# EAGLE schematic SparkFun_GPS_ZED-F9K_pHat (EAGLE 9.5.2)
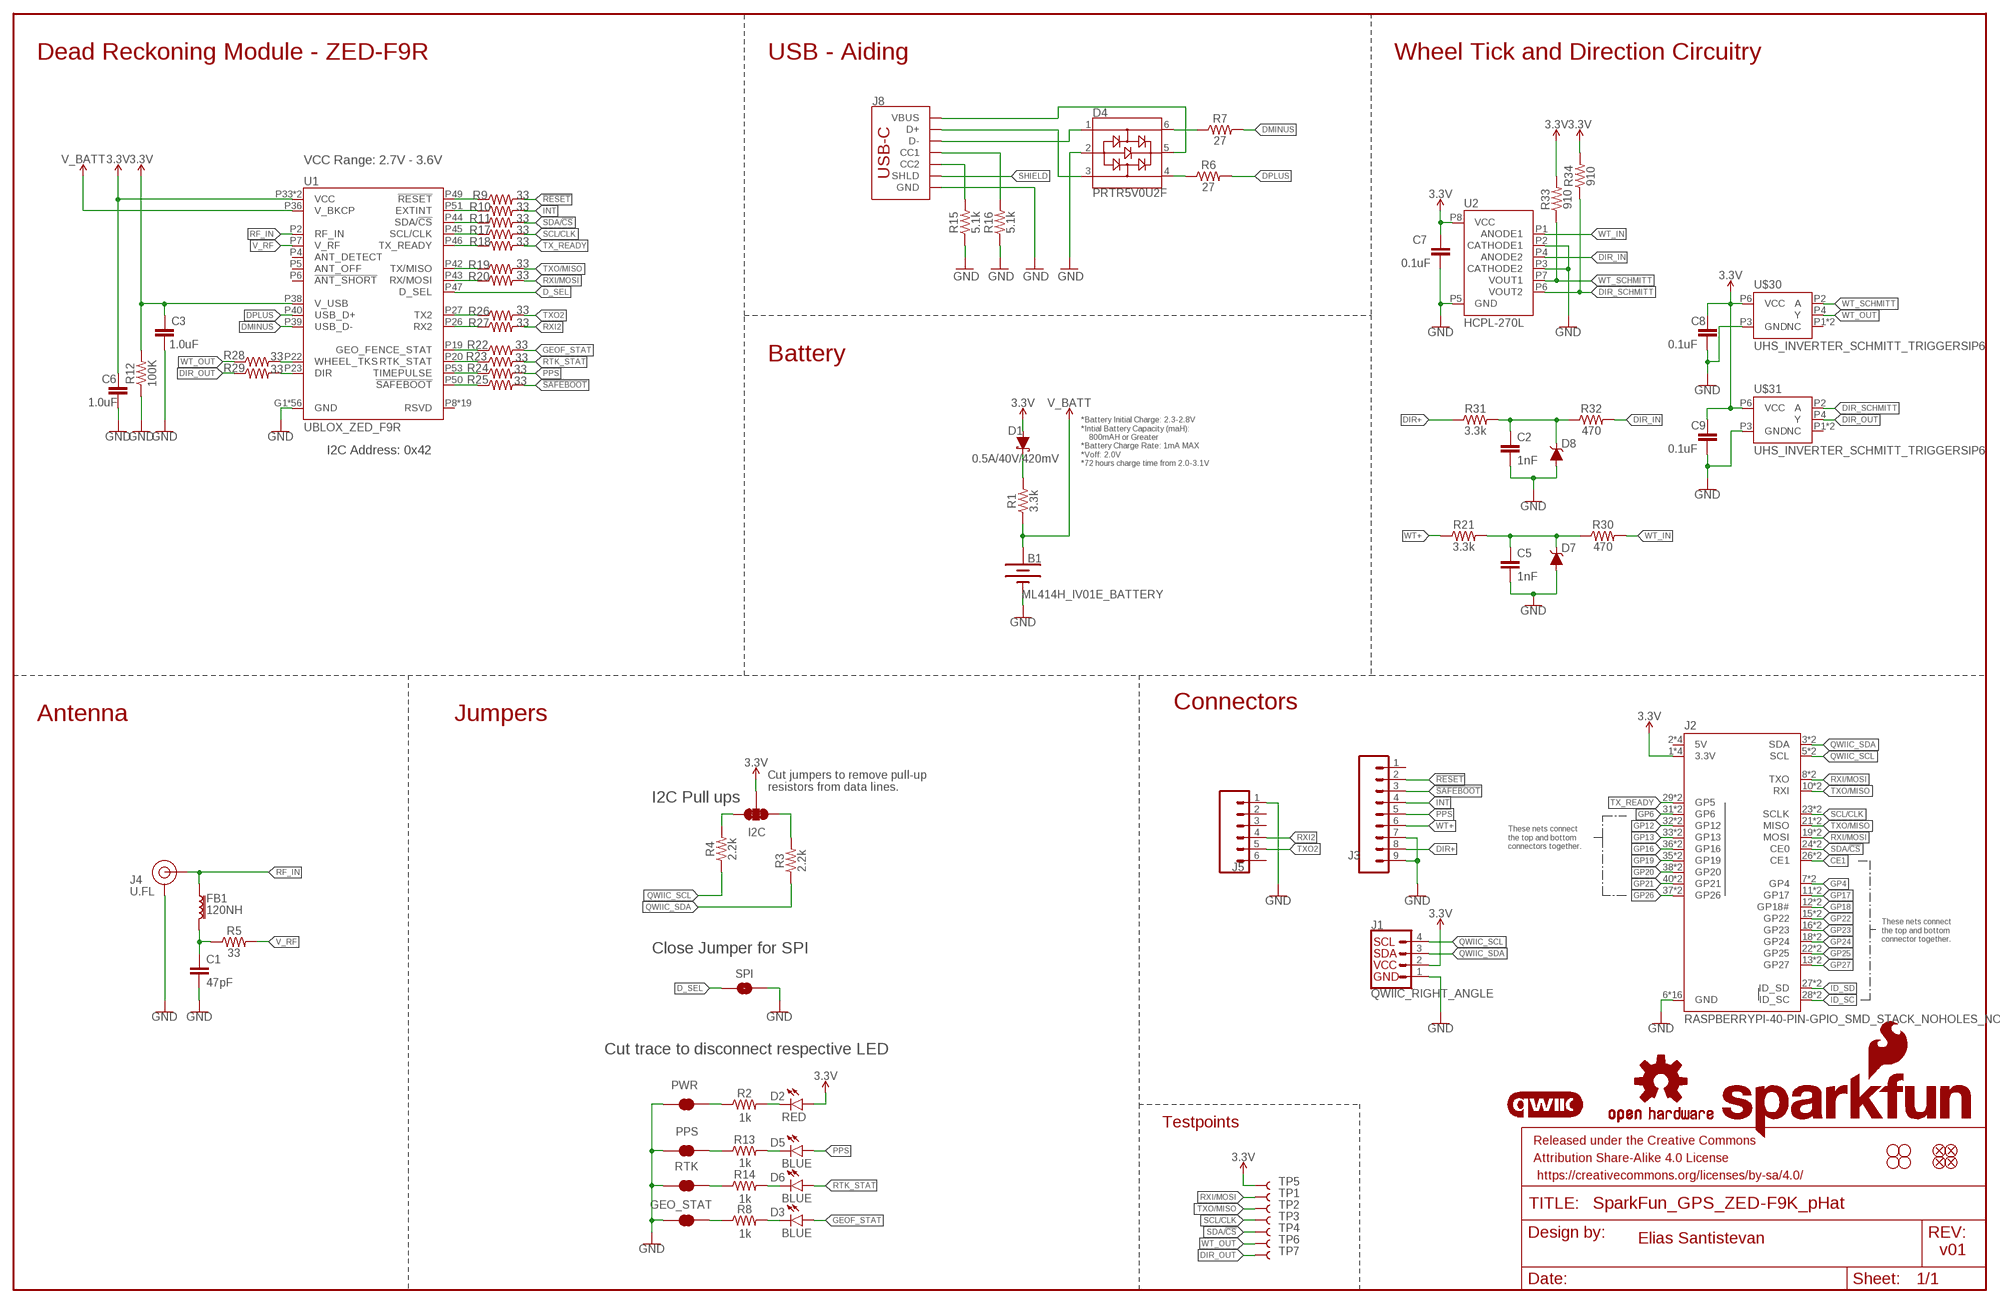
[diagram p0: schematic, sheet 1]

## Parts
B1  ML414H_IV01E_BATTERY  [ML414H_IV01E]
C1  47pF  47PF-0402-25V-5%-X7R  [0402]
C2  1nF  1.0NF/1000PF-0402-25V-10%-X7R  [0402]
C3  1.0uF  1.0UF-0402-16V-10%  [0402]
C5  1nF  1.0NF/1000PF-0402-25V-10%-X7R  [0402]
C6  1.0uF  1.0UF-0402-16V-10%  [0402]
C7  0.1uF  0.1UF-0402-6.3V-10%-X7R  [0402]
C8  0.1uF  0.1UF-0402-6.3V-10%-X7R  [0402]
C9  0.1uF  0.1UF-0402-6.3V-10%-X7R  [0402]
D1  0.5A/40V/420mV  DIODE-SCHOTTKY-PMEG4005EJ  [SOD-323]
D2  RED  LED-RED0603  [LED-0603]
D3  BLUE  LED-BLUE0603  [LED-0603]
D4  PRTR5V0U2F  [SOT886]
D5  BLUE  LED-BLUE0603  [LED-0603]
D6  BLUE  LED-BLUE0603  [LED-0603]
D7  0.5A/40V/420mV  BZX84_DIODE  [SOT23_BZX]
D8  0.5A/40V/420mV  BZX84_DIODE  [SOT23_BZX]
FB1  120NH  FERRITE_BEAD_GNSS  [0402_MURATA]
FD9  FIDUCIALUFIDUCIAL  [FIDUCIAL-MICRO]
FD10  FIDUCIALUFIDUCIAL  [FIDUCIAL-MICRO]
FD11  FIDUCIALUFIDUCIAL  [FIDUCIAL-MICRO]
FD12  FIDUCIALUFIDUCIAL  [FIDUCIAL-MICRO]
FRAME2  FRAME-LEDGER  [CREATIVE_COMMONS]
GEO_STAT  JUMPER-SMT_2_NC_TRACE_SILK  [SMT-JUMPER_2_NC_TRACE_SILK]
H9  STAND-OFFTIGHT  [STAND-OFF-TIGHT]
H10  STAND-OFFTIGHT  [STAND-OFF-TIGHT]
H11  STAND-OFFTIGHT  [STAND-OFF-TIGHT]
H12  STAND-OFFTIGHT  [STAND-OFF-TIGHT]
J1  QWIIC_RIGHT_ANGLE  QWIIC_CONNECTORJS-1MM  [JST04_1MM_RA]
J2  RASPBERRYPI-40-PIN-GPIO_SMD_STACK_NOHOLES_NOREF  [RASPBERRY_PI_HAT_40_PIN_SMD_STACKABLE_NOHOLES_NOREF]
J3  CONN_09NO_SILK  [1X09_NO_SILK]
J4  U.FL  U.FL2PIN  [U.FL]
J5  CONN_06NO_SILK_NO_POP  [1X06_NO_SILK]
J8  USB_C_2-LAYER  [USB-C-16P]
JP1  JUMPER-SMT_2_NO_SILK  [SMT-JUMPER_2_NO_SILK]
JP2  JUMPER-SMT_3_2-NC_TRACE_SILK  [SMT-JUMPER_3_2-NC_TRACE_SILK]
LOGO1  SFE_LOGO_NAME_FLAME.2_INCH  [SFE_LOGO_NAME_FLAME_.2]
LOGO2  OSHW-LOGOM  [OSHW-LOGO-M]
LOGO3  QWIIC_LOGO_5MM  [QWIIC_5MM]
PPS  JUMPER-SMT_2_NC_TRACE_SILK  [SMT-JUMPER_2_NC_TRACE_SILK]
PWR  JUMPER-SMT_2_NC_TRACE_SILK  [SMT-JUMPER_2_NC_TRACE_SILK]
R1  3.3k  3.3KOHM-0603-1/10W-1%  [0603]
R2  1k  1KOHM-0603-1/10W-1%  [0603]
R3  2.2k  2.2KOHM-0603-1/10W-1%  [0603]
R4  2.2k  2.2KOHM-0603-1/10W-1%  [0603]
R5  33  33OHM-0603-1/10W-1%  [0603]
R6  27  27OHM-0603-1/10W-1%  [0603]
R7  27  27OHM-0603-1/10W-1%  [0603]
R8  1k  1KOHM-0603-1/10W-1%  [0603]
R9  33  33OHM-0603-1/10W-1%  [0603]
R10  33  33OHM-0603-1/10W-1%  [0603]
R11  33  33OHM-0603-1/10W-1%  [0603]
R12  100K  100KOHM-0402-1/16W-1%  [0402]
R13  1k  1KOHM-0603-1/10W-1%  [0603]
R14  1k  1KOHM-0603-1/10W-1%  [0603]
R15  5.1k  5.1KOHM-0402-1/16W-1%  [0402]
R16  5.1k  5.1KOHM-0402-1/16W-1%  [0402]
R17  33  33OHM-0603-1/10W-1%  [0603]
R18  33  33OHM-0603-1/10W-1%  [0603]
R19  33  33OHM-0603-1/10W-1%  [0603]
R20  33  33OHM-0603-1/10W-1%  [0603]
R21  3.3k  3.3KOHM-0603-1/10W-1%  [0603]
R22  33  33OHM-0603-1/10W-1%  [0603]
R23  33  33OHM-0603-1/10W-1%  [0603]
R24  33  33OHM-0603-1/10W-1%  [0603]
R25  33  33OHM-0603-1/10W-1%  [0603]
R26  33  33OHM-0603-1/10W-1%  [0603]
R27  33  33OHM-0603-1/10W-1%  [0603]
R28  33  33OHM-0603-1/10W-1%  [0603]
R29  33  33OHM-0603-1/10W-1%  [0603]
R30  470  470OHM-0603-1/10W-1%  [0603]
R31  3.3k  3.3KOHM-0603-1/10W-1%  [0603]
R32  470  470OHM-0603-1/10W-1%  [0603]
R33  910  910OHM-0603-1/10W-5%  [0603]
R34  910  910OHM-0603-1/10W-5%  [0603]
RTK  JUMPER-SMT_2_NC_TRACE_SILK  [SMT-JUMPER_2_NC_TRACE_SILK]
TP1  TEST-POINT3X4  [PAD.03X.04]
TP2  TEST-POINT3X4  [PAD.03X.04]
TP3  TEST-POINT3X4  [PAD.03X.04]
TP4  TEST-POINT3X4  [PAD.03X.04]
TP5  TEST-POINT3X4  [PAD.03X.04]
TP6  TEST-POINT3X4  [PAD.03X.04]
TP7  TEST-POINT3X4  [PAD.03X.04]
U1  UBLOX_ZED_F9R  [UBLOX_ZED_F9R]
U2  HCPL-270L  [SOP_8-PIN]
U$30  UHS_INVERTER_SCHMITT_TRIGGERSIP6  [SIP6]
U$31  UHS_INVERTER_SCHMITT_TRIGGERSIP6  [SIP6]

## Nets
3.3V: C3.1 C6.1 C7.1 C8.1 C9.1 D1.A D2.A J1.2 J2.1(3.3V) J2.1B(3.3V) J2.17(3.3V) J2.17B(3.3V) JP2.2 R12.2 R33.2 R34.2 TP5.P$1 U1.P33(VCC) U1.P34(VCC) U1.P38(V_USB) U2.P8(VCC) U$30.P6(VCC) U$31.P6(VCC)
!RESET: J3.2 R9.2
!SAFEBOOT: J3.3 R25.2
CE1: J2.26(CE1) J2.26B(CE1)
D_SEL: JP1.1 U1.P47(D_SEL)
DIR+: J3.8 R31.1
DIR_IN: R32.2 U2.P4(ANODE2)
DIR_OUT: R29.1 TP7.P$1 U$31.P4(Y)
DIR_SCHMITT: R34.1 U2.P6(VOUT2) U$31.P2(A)
DMINUS: R7.2 U1.P39(USB_D-)
DPLUS: R6.2 U1.P40(USB_D+)
GEOF_STAT: D3.A R22.2
GND: B1.- C1.2 C2.2 C3.2 C5.2 C6.2 C7.2 C8.2 C9.2 D4.2 D7.P1(A) D8.P1(A) GEO_STAT.1 J1.1 J2.6(GND) J2.6B(GND) J2.9(GND) J2.9B(GND) J2.14(GND) J2.14B(GND) J2.20(GND) J2.20B(GND) J2.25(GND) J2.25B(GND) J2.30(GND) J2.30B(GND) J2.34(GND) J2.34B(GND) J2.39(GND) J2.39B(GND) J3.7 J3.9 J4.1(GND) J4.2(GND) J5.1 J8.GND J8.GND2(GND) JP1.2 PPS.1 PWR.1 R12.1 R15.1 R16.1 RTK.1 U1.G1(GND) U1.G2(GND) U1.G3(GND) U1.G4(GND) U1.G5(GND) U1.G6(GND) U1.G7(GND) U1.G8(GND) U1.G9(GND) U1.G10(GND) U1.G11(GND) U1.G12(GND) U1.G13(GND) U1.G14(GND) U1.G15(GND) U1.G16(GND) U1.G17(GND) U1.G18(GND) U1.G19(GND) U1.G20(GND) U1.G21(GND) U1.G22(GND) U1.G23(GND) U1.G24(GND) U1.G25(GND) U1.G26(GND) U1.G27(GND) U1.G28(GND) U1.G29(GND) U1.G30(GND) U1.G31(GND) U1.G32(GND) U1.G33(GND) U1.G34(GND) U1.G35(GND) U1.G36(GND) U1.G37(GND) U1.G38(GND) U1.G39(GND) U1.G40(GND) U1.G41(GND) U1.G42(GND) U1.G43(GND) U1.G44(GND) U1.G45(GND) U1.G46(GND) U1.G47(GND) U1.G48(GND) U1.P1(GND) U1.P3(GND) U1.P12(GND) U1.P14(GND) U1.P32(GND) U1.P37(GND) U1.P41(GND) U1.P48(GND) U2.P2(CATHODE1) U2.P3(CATHODE2) U2.P5(GND) U$30.P3(GND) U$31.P3(GND)
GP4: J2.7(GP4) J2.7B(GP4)
GP6: J2.31(GP6) J2.31B(GP6)
GP12: J2.32(GP12) J2.32B(GP12)
GP13: J2.33(GP13) J2.33B(GP13)
GP16: J2.36(GP16) J2.36B(GP16)
GP17: J2.11(GP17) J2.11B(GP17)
GP18: J2.12(GP18#) J2.12B(GP18#)
GP19: J2.35(GP19) J2.35B(GP19)
GP20: J2.38(GP20) J2.38B(GP20)
GP21: J2.40(GP21) J2.40B(GP21)
GP22: J2.15(GP22) J2.15B(GP22)
GP23: J2.16(GP23) J2.16B(GP23)
GP24: J2.18(GP24) J2.18B(GP24)
GP25: J2.22(GP25) J2.22B(GP25)
GP26: J2.37(GP26) J2.37B(GP26)
GP27: J2.13(GP27) J2.13B(GP27)
ID_SC: J2.28(ID_SC) J2.28B(ID_SC)
ID_SD: J2.27(ID_SD) J2.27B(ID_SD)
INT: J3.4 R10.2
N$1: JP2.1 R3.2
N$2: D1.C R1.2
N$3: JP2.3 R4.2
N$4: D2.C R2.2
N$5: C1.1 FB1.P2 R5.1
N$6: D4.6 R7.1
N$7: D4.4 R6.1
N$8: PWR.2 R2.1
N$9: D4.3 J8.A6(D+) J8.B6(D+)
N$10: D4.5 J8.VBUS1(VBUS) J8.VBUS2(VBUS)
N$11: D4.1 J8.A7(D-) J8.B7(D-)
N$12: J8.B5(CC2) R15.2
N$13: R9.1 U1.P49(!RESET!)
N$14: R10.1 U1.P51(EXTINT)
N$15: R11.1 U1.P44(SDA/!CS!)
N$16: GEO_STAT.2 R8.1
N$17: D3.C R8.2
N$18: J8.A5(CC1) R16.2
N$19: R17.1 U1.P45(SCL/CLK)
N$20: R18.1 U1.P46(TX_READY)
N$21: R19.1 U1.P42(TX/MISO)
N$22: R14.1 RTK.2
N$23: PPS.2 R13.1
N$24: D5.C R13.2
N$25: D6.C R14.2
N$26: R20.1 U1.P43(RX/MOSI)
N$27: C5.1 D7.P3(C) R21.2 R30.1
N$28: R22.1 U1.P19(GEO_FENCE_STAT)
N$29: R23.1 U1.P20(RTK_STAT)
N$30: R24.1 U1.P53(TIMEPULSE)
N$31: R25.1 U1.P50(!SAFEBOOT!)
N$32: R26.1 U1.P27(TX2)
N$33: R27.1 U1.P26(RX2)
N$34: R28.2 U1.P22(WHEEL_TKS)
N$35: R29.2 U1.P23(DIR)
N$36: C2.1 D8.P3(C) R31.2 R32.1
PPS: D5.A J3.5 R24.2
QWIIC_SCL: J1.4 J2.5(SCL) J2.5B(SCL) R4.1
QWIIC_SDA: J1.3 J2.3(SDA) J2.3B(SDA) R3.1
RF_IN [Antenna]: FB1.P1 J4.FEED(SIGNAL) U1.P2(RF_IN)
RTK_STAT: D6.A R23.2
RXI2: J5.4 R27.2
RXI/MOSI: J2.8(TXO) J2.8B(TXO) J2.19(MOSI) J2.19B(MOSI) R20.2 TP1.P$1
SCL/CLK: J2.23(SCLK) J2.23B(SCLK) R17.2 TP3.P$1
SDA/!CS: J2.24(CE0) J2.24B(CE0) R11.2 TP4.P$1
SHIELD: J8.SHLD1(SHLD) J8.SHLD2(SHLD) J8.SHLD3(SHLD) J8.SHLD4(SHLD) J8.SHLD5(SHLD) J8.SHLD6(SHLD) J8.SHLD7(SHLD) J8.SHLD8(SHLD)
TX_READY: J2.29(GP5) J2.29B(GP5) R18.2
TXO2: J5.5 R26.2
TXO/MISO: J2.10(RXI) J2.10B(RXI) J2.21(MISO) J2.21B(MISO) R19.2 TP2.P$1
V_BATT: B1.+ R1.1 U1.P36(V_BKCP)
V_RF: R5.2 U1.P7(V_RF)
WT+: J3.6 R21.1
WT_IN: R30.2 U2.P1(ANODE1)
WT_OUT: R28.1 TP6.P$1 U$30.P4(Y)
WT_SCHMITT: R33.1 U2.P7(VOUT1) U$30.P2(A)
Unconnected: J3.1 J5.2 J5.3 J5.6 U1.P4(ANT_DETECT) U1.P5(ANT_OFF) U1.P6(!ANT_SHORT!) U1.P8(RSVD) U1.P9(RSVD) U1.P10(RSVD) U1.P11(RSVD) U1.P13(RSVD) U1.P15(RSVD) U1.P16(RSVD) U1.P17(RSVD) U1.P18(RSVD) U1.P21(RSVD) U1.P24(RSVD) U1.P25(RSVD) U1.P28(RSVD) U1.P29(RSVD) U1.P30(RSVD) U1.P31(RSVD) U1.P35(RSVD) U1.P52(RSVD) U1.P54(RSVD) U$30.P1(NC) U$30.P5(NC) U$31.P1(NC) U$31.P5(NC)

## Notes on the sheet
- Dead Reckoning Module - ZED-F9R | USB - Aiding | Wheel Tick and Direction Circuitry
- VCC Range: 2.7V - 3.6V
- Battery
- I2C Address: 0x42
- *Battery Initial Charge: 2.3-2.8V
  *Intial Battery Capacity (maH): 
      800mAH or Greater
  *Battery Charge Rate: 1mA MAX
  *Voff: 2.0V
  *72 hours charge time from 2.0-3.1V
- Connectors
- Antenna | Jumpers
- Cut jumpers to remove pull-up
  resistors from data lines.
- I2C Pull ups
- I2C
- These nets connect
  the top and bottom
  connectors together.
- These nets connect 
  the top and bottom 
  connector together.
- Close Jumper for SPI
- SPI
- Cut trace to disconnect respective LED
- 1k
- Testpoints
- 1k
- 1k
- 1k
- Elias Santistevan
- v01

## Power pins joined to a net without a drawn wire
5V: J2.2(5V) J2.2B(5V) J2.4(5V) J2.4B(5V)

## Library data of the parts
B1 = SparkFun-Batteries:ML414H_IV01E_BATTERY: SEIKO ML414H-IV01E Reflowable Lithium Battery ML414H is a rechargeable, coin type battery with features such as Pb-free reflowable (Peak temperature: 260 C) and high temperature heat resistance. Battery Characteristics: 3.1V max voltage Voff is 2V 1mAH 3k series resistor with battery 72 hour charge time from 2.0-3.1V 2.3-2.8V initial charge; PROD_ID: BATT-14267
C1 = SparkFun-Capacitors:47PF: 47pF ceramic capacitors A capacitor is a passive two-terminal electrical component used to store electrical energy temporarily in an electric field.; PROD_ID: CAP-15063
C2 C5 = SparkFun-Capacitors:1.0NF/1000PF: 1nF/1,000pF ceramic capacitors A capacitor is a passive two-terminal electrical component used to store electrical energy temporarily in an electric field.; PROD_ID: CAP-15061
C3 C6 = SparkFun-Capacitors:1.0UF: 1µF ceramic capacitors A capacitor is a passive two-terminal electrical component used to store electrical energy temporarily in an electric field.; PROD_ID: CAP-12417
C7-C9 = SparkFun-Capacitors:0.1UF: 0.1µF ceramic capacitors A capacitor is a passive two-terminal electrical component used to store electrical energy temporarily in an electric field.; PROD_ID: CAP-14993
D1 = SparkFun-DiscreteSemi:DIODE-SCHOTTKY: Schottky diode A Schottky diode is a semiconductor diode which has a low forward voltage drop and a very fast switching action.; PROD_ID: DIO-10955
D2 = SparkFun-LED:LED-RED: Red SMD LED Used in manufacturing of most products at SparkFun Packages: 0603 - SMD 0603 package [Product Link] <http://docs.avagotech.com/docs/AV02-0551EN> 0603 SMART - SMD 0603 SMART package ( more efficient and expensive)[Product Link] <http://www.osram-os.com/Graphics/XPic2/00077099_0.pdf> 1206 - SMD1206 package [Product Link] <https://www.sparkfun.com/datasheets/DevTools/LilyPad/Q150OVS4.pdff> SparkFun Products: Pro Mini 328 -5V <https://www.sparkfun.com/products/821> RedBoard <https://www.sparkfun.com/products/12757> IOIO-OTG <https://www.sparkfun.com/products/13613>; PROD_ID: DIO-00819
D3 D5 D6 = SparkFun-LED:LED-BLUE: Blue SMD LED Used in manufacturing of various products at SparkFun Packages: 0603 - SMD 0603 package [Product Link] <http://www.digikey.com/product-detail/en/SMLE12BC7TT86/511-1589-2-ND/1641808> 1206 - SMD1206 package [Product Link] <http://www.digikey.com/product-detail/en/lite-on-inc/LTST-C150TBKT/160-1643-1-ND/573584> SparkFun Products: ESP8266 Thing-Dev Board <https://www.sparkfun.com/products/13711> RedBoard <https://www.sparkfun.com/products/12757>; PROD_ID: DIO-08575
D4 = SparkFun-IC-Power:PRTR5V0U2: A small ESD protection device. Most commonly used on USB D+/D- signals to protect large, expensive, or especially sensitive USB enabled devices.; PROD_ID: DIO-14084
D7 D8 = classified:BZX84_DIODE
FB1 = SparkFun-Coils:FERRITE_BEAD_GNSS
FD9-FD12 = SparkFun-Aesthetics:FIDUCIAL: Fiducial Alignment Points Point-of-reference for pick-and-place machines and other optical instruments.
FRAME2 = SparkFun-Aesthetics:FRAME-LEDGER: Schematic Frame - Ledger Standard 11x14 US Ledger frame
GEO_STAT PPS PWR RTK = SparkFun-Jumpers:JUMPER-SMT_2_NC_TRACE: Normally closed trace jumper This jumper has a trace between two pads so it's normally closed (NC). Use a razor knife to open the connection. For best results follow the IPC guidelines for cutting traces: Cutout at least 0.063 mm (0.005 in). Remove all loose material to clean up the cut area. Seal the cut with an approved epoxy. Reapply solder to reclose the connection.
H9-H12 = SparkFun-Hardware:STAND-OFF: Stand Off Drill holes for mechanically mounting via screws, standoffs, etc. Note: Use the keepout ring to avoid running the screw head into surrounding components. Variant Overviews STAND-OFF - Mechanical footprint for a #4 phillips button head screw. STAND-OFF-TIGHT - Mechanical footprint for a #4 phillips button head screw, Example SparkFun Products Screw - Phillips Head (1/4", 4-40, 10 pack) <https://www.sparkfun.com/products/10453> (PRT-10453) Screw - Phillips Head (1/2", 4-40, 10 pack) <https://www.sparkfun.com/products/10452> (PRT-10452) Screw - Phillips Head (3/4", 4-40, 10 pack) <https://www.sparkfun.com/products/10451> (PRT-10451) Screw - Phillips Head (1", 4-40, 10 pack) <https://www.sparkfun.com/products/10450> (PRT-10450)
J1 = SparkFun-Connectors:QWIIC_CONNECTOR: SparkFun I2C Standard Qwiic Connector An SMD 1mm pitch JST connector makes it easy and quick (get it? Qwiic?) to connect I2C devices to each other. The Qwiic system <http://www.sparkfun.com/qwiic> enables fast and solderless connection between popular platforms and various sensors and actuators. We carry 200mm <https://www.sparkfun.com/products/14204>, 100mm <https://www.sparkfun.com/products/14205>, 50mm <https://www.sparkfun.com/products/14206>, and breadboard friendly <https://www.sparkfun.com/products/14207> Qwiic cables. We also offer 10 pcs strips <https://www.sparkfun.com/products/14323> the SMD connectors.; PROD_ID: CONN-13694
J2 = SparkFun-Connectors:RASPBERRYPI-40-PIN-GPIO: Raspberry Pi GPIO Header 2x20 pin connector, as found on B, B+, A+ models. Both shrouded PTH and SMT versions available. SparkFun Products: GPIO Shrouded Header <https://www.sparkfun.com/products/13054>- PTH SparkFun Pi Wedge (Preassembled) <https://www.sparkfun.com/products/13717>
J3 = SparkFun-Connectors:CONN_09: Multi connection point. Often used as Generic Header-pin footprint for 0.1 inch spaced/style header connections On any of the 0.1 inch spaced packages, you can populate with these: Break Away Headers - Straight <https://www.sparkfun.com/products/116> (PRT-00116) Break Away Male Headers - Right Angle <https://www.sparkfun.com/products/553> (PRT-00553) Female Headers <https://www.sparkfun.com/products/115> (PRT-00115) Break Away Headers - Machine Pin <https://www.sparkfun.com/products/117> (PRT-00117) Break Away Female Headers - Swiss Machine Pin <https://www.sparkfun.com/products/743> (PRT-00743) For SCREWTERMINALS and SPRING TERMINALS visit here: Screw Terimnals on SparkFun.com <https://www.sparkfun.com/search/results?term=Screw+Terminals> (5mm/3.5mm/2.54mm spacing) This device is also useful as a general connection point to wire up your design to another part of your project. Our various solder wires solder well into these plated through hole pads. Hook-Up Wire - Assortment (Stranded, 22 AWG) <https://www.sparkfun.com/products/11375> (PRT-11375) Hook-Up Wire - Assortment (Solid Core, 22 AWG) <https://www.sparkfun.com/products/11367> (PRT-11367) View the entire wire category on our website here <https://www.sparkfun.com/categories/141> Special notes: Molex polarized connector foot print use with SKU : PRT-08231 with associated crimp pins and housings. 1MM SMD Version SKU: PRT-10208 NOTES ON THE VARIANTS LOCK and LOCK_LONGPADS... This footprint was designed to help hold the alignment of a through-hole component (i.e. 6-pin header) while soldering it into place. You may notice that each hole has been shifted either up or down by 0.005 of an inch from it's more standard position (which is a perfectly straight line). This slight alteration caused the pins (the squares in the middle) to touch the edges of the holes. Because they are alternating, it causes a "brace" to hold the component in place. 0.005 has proven to be the perfect amount of "off-center" position when using our standard breakaway headers. Although looks a little odd when you look at the bare footprint, once you have a header in there, the alteration is very hard to notice. Also,if you push a header all the way into place, it is covered up entirely on the bottom side.
J4 = SparkFun-Connectors:U.FL2PIN: SMD Antenna Connector - U.FL 2mm height, 3.0mm x 3.0mm receptacle size. SparkFun Products: SparkFun WiFi Shield - ESP8266 <https://www.sparkfun.com/products/13287> SparkFun ESP8266 Thing <https://www.sparkfun.com/products/13231> SparkFun MiniGen - Pro Mini Signal Generator Shield <https://www.sparkfun.com/products/11420>; PROD_ID: CONN-09193; SF_ID: WRL-09144
J5 = SparkFun-Connectors:CONN_06: Multi connection point. Often used as Generic Header-pin footprint for 0.1 inch spaced/style header connections On any of the 0.1 inch spaced packages, you can populate with these: Break Away Headers - Straight <https://www.sparkfun.com/products/116> (PRT-00116) Break Away Male Headers - Right Angle <https://www.sparkfun.com/products/553> (PRT-00553) Female Headers <https://www.sparkfun.com/products/115> (PRT-00115) Break Away Headers - Machine Pin <https://www.sparkfun.com/products/117> (PRT-00117) Break Away Female Headers - Swiss Machine Pin <https://www.sparkfun.com/products/743> (PRT-00743) Arduino Stackable Header - 6 Pin <https://www.sparkfun.com/products/9280> (PRT-09280) For SCREWTERMINALS and SPRING TERMINALS visit here: Screw Terimnals on SparkFun.com <https://www.sparkfun.com/search/results?term=Screw+Terminals> (5mm/3.5mm/2.54mm spacing) This device is also useful as a general connection point to wire up your design to another part of your project. Our various solder wires solder well into these plated through hole pads. Hook-Up Wire - Assortment (Stranded, 22 AWG) <https://www.sparkfun.com/products/11375> (PRT-11375) Hook-Up Wire - Assortment (Solid Core, 22 AWG) <https://www.sparkfun.com/products/11367> (PRT-11367) View the entire wire category on our website here <https://www.sparkfun.com/categories/141>
J8 = SparkFun-Connectors:USB_C: USB Type C 16Pin Connector Super Speed pins not available on the 16-pin purely SMD connector so this part is best for USB 2.0 implementations. D1 and D2 are tied together enabling D+/- no matter which way the cable is plugged into the connector. The two channel configuration pins (CC1/2) are exposed. These are normally connected to ground via 5.1k resistors but can be reconfigured for high current/high power applications.; PROD_ID: CONN-14122
JP1 = SparkFun-Jumpers:JUMPER-SMT_2_NO: Normally open jumper This jumper has two pads in close proximity to each other. Apply solder to close the connection. Round pads are easier to solder for beginners, but are a lot larger. SparkFun Product that uses the round pads: SparkFun EL Sequencer <https://www.sparkfun.com/products/12781>
JP2 = SparkFun-Jumpers:JUMPER-SMT_3_2-NC_TRACE: Normally closed trace jumper (2 of 2 connections) This jumper has a trace between all three pads so they are normally closed (NC). Use a razor knife to open the connection(s). For best results follow the IPC guidelines for cutting traces: Cutout at least 0.063 mm (0.005 in). Remove all loose material to clean up the cut area. Seal the cut with an approved epoxy. Reapply solder to reclose the connection(s).
LOGO1 = SparkFun-Aesthetics:SFE_LOGO_NAME_FLAME: SparkFun Font Logo w/ Flame This is the SparkFun full logo. The logo on the schematic will always be the same size; the package variant is the height of the flame part of the logo. Default layer for the logo on the board is tSilk.
LOGO2 = SparkFun-Aesthetics:OSHW-LOGO: Open-Source Hardware (OSHW) Logo This logo indicates the piece of hardware it is found on incorporates a OSHW license and/or adheres to the definition of open source hardware found here: http://freedomdefined.org/OSHW
LOGO3 = SparkFun-Aesthetics:QWIIC_LOGO: Qwiic Logos for placement on schematic and PCB. The 5.5mm silk logo is best for placing next to Qwiic connector.
R1 R21 R31 = SparkFun-Resistors:3.3KOHM: 3.3kΩ resistor A resistor is a passive two-terminal electrical component that implements electrical resistance as a circuit element. Resistors act to reduce current flow, and, at the same time, act to lower voltage levels within circuits. - Wikipedia; PROD_ID: RES-07851
R2 R8 R13 R14 = SparkFun-Resistors:1KOHM: 1kΩ resistor A resistor is a passive two-terminal electrical component that implements electrical resistance as a circuit element. Resistors act to reduce current flow, and, at the same time, act to lower voltage levels within circuits. - Wikipedia; PROD_ID: RES-07856
R3 R4 = SparkFun-Resistors:2.2KOHM: 2.2kΩ resistor A resistor is a passive two-terminal electrical component that implements electrical resistance as a circuit element. Resistors act to reduce current flow, and, at the same time, act to lower voltage levels within circuits. - Wikipedia; PROD_ID: RES-08272
R5 R9-R11 R17-R20 R22-R29 = SparkFun-Resistors:33OHM: 33Ω resistor A resistor is a passive two-terminal electrical component that implements electrical resistance as a circuit element. Resistors act to reduce current flow, and, at the same time, act to lower voltage levels within circuits. - Wikipedia; PROD_ID: RES-08270
R6 R7 = SparkFun-Resistors:27OHM: 27Ω resistor A resistor is a passive two-terminal electrical component that implements electrical resistance as a circuit element. Resistors act to reduce current flow, and, at the same time, act to lower voltage levels within circuits. - Wikipedia; PROD_ID: RES-09334
R12 = SparkFun-Resistors:100KOHM: 100kΩ resistor A resistor is a passive two-terminal electrical component that implements electrical resistance as a circuit element. Resistors act to reduce current flow, and, at the same time, act to lower voltage levels within circuits. - Wikipedia; PROD_ID: RES-13495
R15 R16 = SparkFun-Resistors:5.1KOHM; PROD_ID: RES-14340
R30 R32 = SparkFun-Resistors:470OHM: 470Ω resistor A resistor is a passive two-terminal electrical component that implements electrical resistance as a circuit element. Resistors act to reduce current flow, and, at the same time, act to lower voltage levels within circuits. - Wikipedia; PROD_ID: RES-07869
R33 R34 = classified:910OHM-0603-1/10W-5%: 910 Ohm Resistor Digikey Link <https://www.digikey.com/product-detail/en/yageo/RC0603JR-07910RL/311-910GRTR-ND/726838>
TP1-TP7 = SparkFun-Connectors:TEST-POINT: SparkFun Test Points Bare copper test points for troubleshooting or In-Circuit-Testing. These are used by our Production team for verifying production board runs using pogo-pins on test beds. SparkFun Products: SparkFun LSM9DS1 Breakout <https://www.sparkfun.com/products/13284> SparkFun PSOC <https://www.sparkfun.com/products/13714> SparkFun Load Cell Amplifier <https://www.sparkfun.com/products/13879>
U1 = classified:UBLOX_ZED_F9R: u-blox ZED-F9K ADR GPS Unit with Real Time Kinematics (RTK) and internal IMU = Automotive Dead Reckoning; PROD_ID: IC-14716
U2 = classified:HCPL-270L: HCPL-270L These high gain series couplers use a Light Emitting Diode and an integrated high gain photodetector to provide extremely high current transfer ratio between input and output. Separate pins for the photodiode and output stage result in LVTTL compatible saturation voltages and high speed operation. Where desired, the VCC and VO terminals may be tied together to achieve conventional photo-darlington operation. A base access terminal allows a gain bandwidth adjustment to be made. These optocouplers are for use in LVTTL/LVCMOS or other low power applications. A 400% minimum current transfer ratio is guaranteed over 0 to +70˚C operating range for only 0.5 mA of LED current. Digikey Link <https://www.digikey.com/products/en?mpart=HCPL-070L-500E&v=516>
U$30 U$31 = classified:UHS_INVERTER_SCHMITT_TRIGGER: NC7SZ14 The NC7SZ14 is a single inverter with Schmitt trigger input from ON Semiconductor’s Ultra−High Speed (UHS) series of TinyLogic. The device is fabricated w ith advanced CMOS technology to achieve ultra−high speed with high output drive while maintaining low static power dissipation over a very broad VCC operating range. The device is specified to operate over the 1.65 V to 5.5 V VCC range. The inputs and outputs are high−impedance when VCC is 0 V. Inputs tolerate voltages up to 5.5 V independent of VCC operating voltage. Digikey Link <https://www.digikey.com/product-detail/en/on-semiconductor/NC7SZ14M5X/NC7SZ14M5XDKR-ND/1628606>

## Net classes
1 Antenna: width 1 mm, clearance 0.3 mm